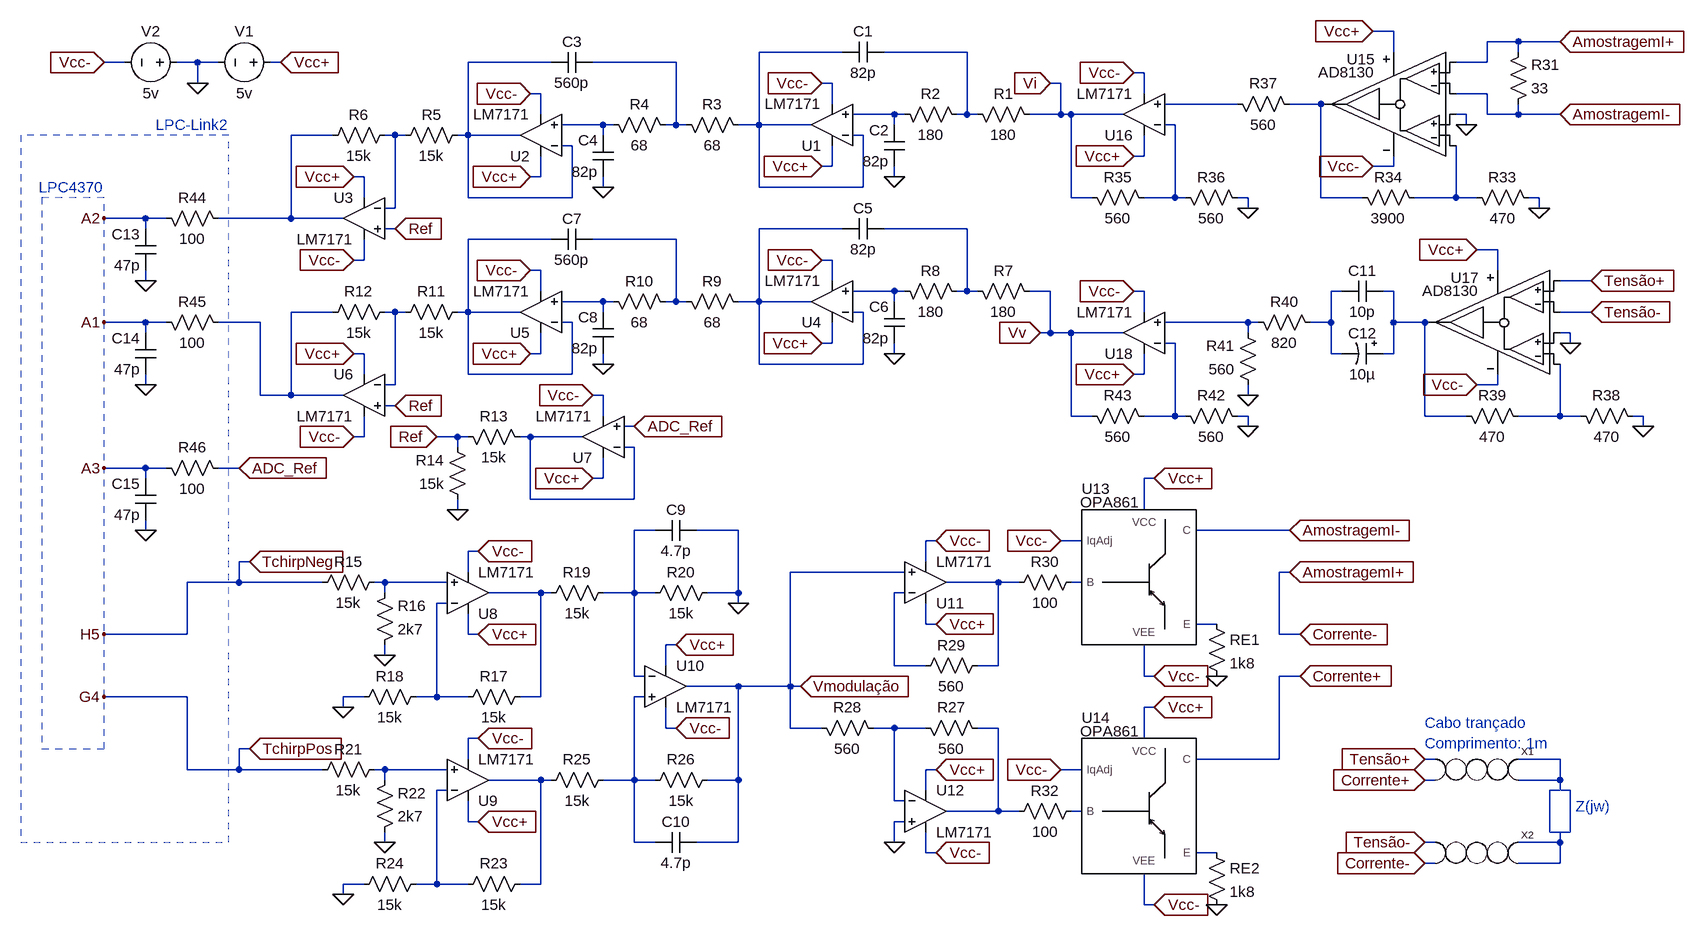
[diagram p0: schematic Circuito completo - Cop.asc]
Circuito completo - Cop.asc, the LTspice schematic file:
Version 4
SHEET 1 960 1160
WIRE -3216 -880 -3248 -880
WIRE -3024 -864 -3072 -864
WIRE -2960 -864 -3024 -864
WIRE -4064 -848 -4192 -848
WIRE -3872 -848 -4000 -848
WIRE -3216 -848 -3216 -880
WIRE -3024 -848 -3024 -864
WIRE -5168 -832 -5200 -832
WIRE -5056 -832 -5088 -832
WIRE -5024 -832 -5056 -832
WIRE -4928 -832 -4944 -832
WIRE -4512 -832 -4640 -832
WIRE -4320 -832 -4448 -832
WIRE -3072 -832 -3072 -864
WIRE -3072 -832 -3120 -832
WIRE -3600 -816 -3616 -816
WIRE -5056 -800 -5056 -832
WIRE -4080 -800 -4096 -800
WIRE -3728 -800 -3744 -800
WIRE -4528 -784 -4544 -784
WIRE -3600 -784 -3600 -816
WIRE -3072 -784 -3120 -784
WIRE -4080 -768 -4080 -800
WIRE -3456 -768 -3568 -768
WIRE -3328 -768 -3376 -768
WIRE -4528 -752 -4528 -784
WIRE -3984 -752 -4048 -752
WIRE -3968 -752 -3984 -752
WIRE -3872 -752 -3872 -848
WIRE -3872 -752 -3888 -752
WIRE -3856 -752 -3872 -752
WIRE -3728 -752 -3728 -800
WIRE -3728 -752 -3776 -752
WIRE -3712 -752 -3728 -752
WIRE -3632 -752 -3712 -752
WIRE -3104 -752 -3120 -752
WIRE -3072 -752 -3072 -784
WIRE -3024 -752 -3024 -768
WIRE -3024 -752 -3072 -752
WIRE -2960 -752 -3024 -752
WIRE -4432 -736 -4496 -736
WIRE -4416 -736 -4432 -736
WIRE -4320 -736 -4320 -832
WIRE -4320 -736 -4336 -736
WIRE -4304 -736 -4320 -736
WIRE -4192 -736 -4192 -848
WIRE -4192 -736 -4224 -736
WIRE -4112 -736 -4192 -736
WIRE -3984 -736 -3984 -752
WIRE -3552 -736 -3568 -736
WIRE -3104 -736 -3104 -752
WIRE -4848 -720 -4912 -720
WIRE -4752 -720 -4768 -720
WIRE -4736 -720 -4752 -720
WIRE -4640 -720 -4640 -832
WIRE -4640 -720 -4656 -720
WIRE -4560 -720 -4640 -720
WIRE -4432 -720 -4432 -736
WIRE -4032 -720 -4048 -720
WIRE -4480 -704 -4496 -704
WIRE -3600 -688 -3600 -720
WIRE -3600 -688 -3616 -688
WIRE -4080 -672 -4080 -704
WIRE -4080 -672 -4096 -672
WIRE -3216 -672 -3216 -688
WIRE -3216 -672 -3248 -672
WIRE -4800 -656 -4816 -656
WIRE -4528 -656 -4528 -688
WIRE -4528 -656 -4544 -656
WIRE -3984 -656 -3984 -672
WIRE -4432 -640 -4432 -656
WIRE -4192 -640 -4192 -736
WIRE -4032 -640 -4032 -720
WIRE -4032 -640 -4192 -640
WIRE -4800 -624 -4800 -656
WIRE -4640 -624 -4640 -720
WIRE -4480 -624 -4480 -704
WIRE -4480 -624 -4640 -624
WIRE -3712 -624 -3712 -752
WIRE -3680 -624 -3712 -624
WIRE -3552 -624 -3552 -736
WIRE -3552 -624 -3600 -624
WIRE -3536 -624 -3552 -624
WIRE -3440 -624 -3456 -624
WIRE -3328 -624 -3328 -768
WIRE -3264 -624 -3328 -624
WIRE -3120 -624 -3120 -704
WIRE -3120 -624 -3184 -624
WIRE -3088 -624 -3120 -624
WIRE -2992 -624 -3008 -624
WIRE -4752 -608 -4752 -720
WIRE -4752 -608 -4768 -608
WIRE -3440 -608 -3440 -624
WIRE -2992 -608 -2992 -624
WIRE -5136 -592 -5200 -592
WIRE -5104 -592 -5136 -592
WIRE -4912 -592 -4912 -720
WIRE -4912 -592 -5024 -592
WIRE -4832 -592 -4912 -592
WIRE -5136 -576 -5136 -592
WIRE -4752 -576 -4768 -576
WIRE -4064 -576 -4192 -576
WIRE -3872 -576 -4000 -576
WIRE -4512 -560 -4640 -560
WIRE -4320 -560 -4448 -560
WIRE -3056 -544 -3088 -544
WIRE -4800 -528 -4800 -560
WIRE -4800 -528 -4816 -528
WIRE -4080 -528 -4096 -528
WIRE -4528 -512 -4544 -512
WIRE -3056 -512 -3056 -544
WIRE -5136 -496 -5136 -512
WIRE -4080 -496 -4080 -528
WIRE -2912 -496 -2960 -496
WIRE -4528 -480 -4528 -512
WIRE -3984 -480 -4048 -480
WIRE -3968 -480 -3984 -480
WIRE -3872 -480 -3872 -576
WIRE -3872 -480 -3888 -480
WIRE -3856 -480 -3872 -480
WIRE -3744 -480 -3776 -480
WIRE -3600 -480 -3616 -480
WIRE -3296 -480 -3312 -480
WIRE -3216 -480 -3232 -480
WIRE -4432 -464 -4496 -464
WIRE -4416 -464 -4432 -464
WIRE -4320 -464 -4320 -560
WIRE -4320 -464 -4336 -464
WIRE -4304 -464 -4320 -464
WIRE -4192 -464 -4192 -576
WIRE -4192 -464 -4224 -464
WIRE -4112 -464 -4192 -464
WIRE -3984 -464 -3984 -480
WIRE -4848 -448 -4912 -448
WIRE -4752 -448 -4768 -448
WIRE -4736 -448 -4752 -448
WIRE -4640 -448 -4640 -560
WIRE -4640 -448 -4656 -448
WIRE -4560 -448 -4640 -448
WIRE -4432 -448 -4432 -464
WIRE -4032 -448 -4048 -448
WIRE -3600 -448 -3600 -480
WIRE -2912 -448 -2960 -448
WIRE -5136 -432 -5200 -432
WIRE -5104 -432 -5136 -432
WIRE -4960 -432 -5024 -432
WIRE -4480 -432 -4496 -432
WIRE -3440 -432 -3568 -432
WIRE -3424 -432 -3440 -432
WIRE -3312 -432 -3312 -480
WIRE -3312 -432 -3344 -432
WIRE -3216 -432 -3216 -480
WIRE -3168 -432 -3216 -432
WIRE -5136 -416 -5136 -432
WIRE -3744 -416 -3744 -480
WIRE -3744 -416 -3760 -416
WIRE -3712 -416 -3744 -416
WIRE -3632 -416 -3712 -416
WIRE -3440 -416 -3440 -432
WIRE -2944 -416 -2960 -416
WIRE -4080 -400 -4080 -432
WIRE -4080 -400 -4096 -400
WIRE -3552 -400 -3568 -400
WIRE -2944 -400 -2944 -416
WIRE -4800 -384 -4816 -384
WIRE -4528 -384 -4528 -416
WIRE -4528 -384 -4544 -384
WIRE -3984 -384 -3984 -400
WIRE -3312 -384 -3312 -432
WIRE -3296 -384 -3312 -384
WIRE -3216 -384 -3216 -432
WIRE -3216 -384 -3232 -384
WIRE -4432 -368 -4432 -384
WIRE -4192 -368 -4192 -464
WIRE -4032 -368 -4032 -448
WIRE -4032 -368 -4192 -368
WIRE -4800 -352 -4800 -384
WIRE -4640 -352 -4640 -448
WIRE -4480 -352 -4480 -432
WIRE -4480 -352 -4640 -352
WIRE -3600 -352 -3600 -384
WIRE -3600 -352 -3616 -352
WIRE -5136 -336 -5136 -352
WIRE -4752 -336 -4752 -448
WIRE -4752 -336 -4768 -336
WIRE -3056 -336 -3056 -352
WIRE -3056 -336 -3088 -336
WIRE -4960 -320 -4960 -432
WIRE -4912 -320 -4912 -448
WIRE -4912 -320 -4960 -320
WIRE -4832 -320 -4912 -320
WIRE -4432 -320 -4448 -320
WIRE -3440 -320 -3440 -336
WIRE -4752 -304 -4768 -304
WIRE -4432 -288 -4432 -320
WIRE -3712 -288 -3712 -416
WIRE -3680 -288 -3712 -288
WIRE -3552 -288 -3552 -400
WIRE -3552 -288 -3600 -288
WIRE -3536 -288 -3552 -288
WIRE -3440 -288 -3456 -288
WIRE -3168 -288 -3168 -432
WIRE -3104 -288 -3168 -288
WIRE -2960 -288 -2960 -368
WIRE -2960 -288 -3024 -288
WIRE -2928 -288 -2960 -288
WIRE -2832 -288 -2848 -288
WIRE -4384 -272 -4400 -272
WIRE -3440 -272 -3440 -288
WIRE -2832 -272 -2832 -288
WIRE -4800 -256 -4800 -288
WIRE -4800 -256 -4816 -256
WIRE -4656 -256 -4688 -256
WIRE -4640 -256 -4656 -256
WIRE -4544 -256 -4560 -256
WIRE -4464 -256 -4544 -256
WIRE -4656 -240 -4656 -256
WIRE -4384 -240 -4400 -240
WIRE -5136 -208 -5200 -208
WIRE -5104 -208 -5136 -208
WIRE -4992 -208 -5024 -208
WIRE -5136 -192 -5136 -208
WIRE -4432 -192 -4432 -224
WIRE -4432 -192 -4448 -192
WIRE -3584 -192 -3600 -192
WIRE -4544 -160 -4544 -256
WIRE -4384 -160 -4384 -240
WIRE -4384 -160 -4544 -160
WIRE -4656 -144 -4656 -160
WIRE -3600 -144 -3600 -192
WIRE -5136 -112 -5136 -128
WIRE -4352 -112 -4384 -112
WIRE -4224 -112 -4288 -112
WIRE -3376 -112 -3520 -112
WIRE -3920 -96 -3936 -96
WIRE -3696 -96 -3728 -96
WIRE -4624 -80 -4640 -80
WIRE -4976 -64 -4992 -64
WIRE -3936 -64 -3936 -96
WIRE -4640 -48 -4640 -80
WIRE -3968 -48 -4144 -48
WIRE -3376 -48 -3392 -48
WIRE -4992 -32 -4992 -64
WIRE -4992 -32 -5072 -32
WIRE -4864 -32 -4992 -32
WIRE -4768 -32 -4784 -32
WIRE -4672 -32 -4768 -32
WIRE -3824 -32 -3904 -32
WIRE -3792 -32 -3824 -32
WIRE -3696 -32 -3712 -32
WIRE -4768 -16 -4768 -32
WIRE -4528 -16 -4608 -16
WIRE -4512 -16 -4528 -16
WIRE -4384 -16 -4384 -112
WIRE -4384 -16 -4432 -16
WIRE -4352 -16 -4384 -16
WIRE -4224 -16 -4224 -112
WIRE -4224 -16 -4272 -16
WIRE -3968 -16 -3984 -16
WIRE -4672 0 -4688 0
WIRE -4224 0 -4224 -16
WIRE -3936 32 -3936 0
WIRE -3920 32 -3936 32
WIRE -3488 32 -3520 32
WIRE -5072 48 -5072 -32
WIRE -5072 48 -5200 48
WIRE -4640 48 -4640 16
WIRE -4624 48 -4640 48
WIRE -3392 48 -3392 -48
WIRE -3360 48 -3392 48
WIRE -4320 64 -4336 64
WIRE -4768 80 -4768 64
WIRE -4336 96 -4336 64
WIRE -3984 96 -3984 -16
WIRE -3936 96 -3984 96
WIRE -3824 96 -3824 -32
WIRE -3824 96 -3856 96
WIRE -4384 112 -4384 -16
WIRE -4368 112 -4384 112
WIRE -3600 112 -3600 64
WIRE -3584 112 -3600 112
WIRE -3360 112 -3392 112
WIRE -4224 128 -4304 128
WIRE -4144 128 -4144 -48
WIRE -4144 128 -4224 128
WIRE -4128 128 -4144 128
WIRE -5072 144 -5200 144
WIRE -4800 144 -4832 144
WIRE -4688 144 -4688 0
WIRE -4688 144 -4720 144
WIRE -4640 144 -4688 144
WIRE -4528 144 -4528 -16
WIRE -4528 144 -4560 144
WIRE -4368 144 -4384 144
WIRE -4832 160 -4832 144
WIRE -3584 160 -3600 160
WIRE -4336 192 -4336 160
WIRE -4320 192 -4336 192
WIRE -4144 192 -4144 128
WIRE -4096 192 -4144 192
WIRE -3984 192 -4016 192
WIRE -3936 192 -3984 192
WIRE -3824 192 -3856 192
WIRE -4624 208 -4640 208
WIRE -3600 208 -3600 160
WIRE -4976 224 -4992 224
WIRE -4640 240 -4640 208
WIRE -3392 240 -3392 112
WIRE -3392 240 -3520 240
WIRE -3152 240 -3168 240
WIRE -2960 240 -3024 240
WIRE -5072 256 -5072 144
WIRE -4992 256 -4992 224
WIRE -4992 256 -5072 256
WIRE -4864 256 -4992 256
WIRE -4768 256 -4784 256
WIRE -4672 256 -4768 256
WIRE -3920 256 -3936 256
WIRE -3696 256 -3728 256
WIRE -4768 272 -4768 256
WIRE -4528 272 -4608 272
WIRE -4512 272 -4528 272
WIRE -4384 272 -4384 144
WIRE -4384 272 -4432 272
WIRE -4352 272 -4384 272
WIRE -4224 272 -4224 128
WIRE -4224 272 -4272 272
WIRE -3152 272 -3168 272
WIRE -2960 272 -2960 240
WIRE -2960 272 -3024 272
WIRE -4672 288 -4688 288
WIRE -3936 288 -3936 256
WIRE -2960 288 -2960 272
WIRE -3984 304 -3984 192
WIRE -3968 304 -3984 304
WIRE -3824 320 -3824 192
WIRE -3824 320 -3904 320
WIRE -3792 320 -3824 320
WIRE -3696 320 -3712 320
WIRE -4640 336 -4640 304
WIRE -4624 336 -4640 336
WIRE -3968 336 -3984 336
WIRE -4768 368 -4768 352
WIRE -4384 368 -4384 272
WIRE -4352 368 -4384 368
WIRE -4224 368 -4224 272
WIRE -4224 368 -4288 368
WIRE -3984 368 -3984 336
WIRE -3152 368 -3168 368
WIRE -2960 368 -2960 352
WIRE -2960 368 -3024 368
WIRE -3936 384 -3936 352
WIRE -3920 384 -3936 384
WIRE -3488 384 -3520 384
WIRE -3152 400 -3168 400
WIRE -2960 400 -2960 368
WIRE -2960 400 -3024 400
WIRE -4800 432 -4832 432
WIRE -4688 432 -4688 288
WIRE -4688 432 -4720 432
WIRE -4640 432 -4688 432
WIRE -4528 432 -4528 272
WIRE -4528 432 -4560 432
WIRE -4832 448 -4832 432
WIRE -3600 464 -3600 416
WIRE -3584 464 -3600 464
FLAG -3984 -656 0
FLAG -4096 -672 Vcc+
IOPIN -4096 -672 In
FLAG -4096 -800 Vcc-
IOPIN -4096 -800 In
FLAG -4432 -640 0
FLAG -4544 -656 Vcc+
IOPIN -4544 -656 In
FLAG -4544 -784 Vcc-
IOPIN -4544 -784 In
FLAG -4816 -656 Vcc+
IOPIN -4816 -656 In
FLAG -4816 -528 Vcc-
IOPIN -4816 -528 In
FLAG -3984 -384 0
FLAG -4096 -400 Vcc+
IOPIN -4096 -400 In
FLAG -4096 -528 Vcc-
IOPIN -4096 -528 In
FLAG -4432 -368 0
FLAG -4544 -384 Vcc+
IOPIN -4544 -384 In
FLAG -4544 -512 Vcc-
IOPIN -4544 -512 In
FLAG -4816 -384 Vcc+
IOPIN -4816 -384 In
FLAG -4816 -256 Vcc-
IOPIN -4816 -256 In
FLAG -4448 -192 Vcc+
IOPIN -4448 -192 In
FLAG -4448 -320 Vcc-
IOPIN -4448 -320 In
FLAG -4656 -144 0
FLAG -4992 -208 ADC_Ref
IOPIN -4992 -208 In
FLAG -4688 -256 Ref
IOPIN -4688 -256 In
FLAG -4752 -304 Ref
IOPIN -4752 -304 In
FLAG -4752 -576 Ref
IOPIN -4752 -576 In
FLAG -4624 48 Vcc+
IOPIN -4624 48 In
FLAG -4624 -80 Vcc-
IOPIN -4624 -80 In
FLAG -4768 80 0
FLAG -4624 336 Vcc+
IOPIN -4624 336 In
FLAG -4624 208 Vcc-
IOPIN -4624 208 In
FLAG -4768 368 0
FLAG -4320 64 Vcc+
IOPIN -4320 64 In
FLAG -4320 192 Vcc-
IOPIN -4320 192 In
FLAG -4224 0 0
FLAG -4976 -64 TchirpNeg
IOPIN -4976 -64 In
FLAG -4976 224 TchirpPos
IOPIN -4976 224 In
FLAG -4832 448 0
FLAG -4832 160 0
FLAG -3920 32 Vcc+
IOPIN -3920 32 In
FLAG -3920 -96 Vcc-
IOPIN -3920 -96 In
FLAG -3920 256 Vcc+
IOPIN -3920 256 In
FLAG -3920 384 Vcc-
IOPIN -3920 384 In
FLAG -3584 112 Vcc-
IOPIN -3584 112 In
FLAG -3584 -192 Vcc+
IOPIN -3584 -192 In
FLAG -3488 112 0
FLAG -3584 464 Vcc-
IOPIN -3584 464 In
FLAG -3584 160 Vcc+
IOPIN -3584 160 In
FLAG -3488 464 0
FLAG -3728 -96 Vcc-
IOPIN -3728 -96 In
FLAG -3728 256 Vcc-
IOPIN -3728 256 In
FLAG -3104 -736 0
FLAG -2992 -608 0
FLAG -3616 -688 Vcc+
IOPIN -3616 -688 In
FLAG -3616 -816 Vcc-
IOPIN -3616 -816 In
FLAG -3440 -608 0
FLAG -3248 -672 Vcc-
IOPIN -3248 -672 In
FLAG -3248 -880 Vcc+
IOPIN -3248 -880 In
FLAG -3376 -112 AmostragemI-
IOPIN -3376 -112 In
FLAG -3376 -48 AmostragemI+
IOPIN -3376 -48 In
FLAG -2960 -752 AmostragemI-
IOPIN -2960 -752 In
FLAG -2960 -864 AmostragemI+
IOPIN -2960 -864 In
FLAG -2944 -400 0
FLAG -2832 -272 0
FLAG -3616 -352 Vcc+
IOPIN -3616 -352 In
FLAG -3616 -480 Vcc-
IOPIN -3616 -480 In
FLAG -3440 -272 0
FLAG -3088 -336 Vcc-
IOPIN -3088 -336 In
FLAG -3088 -544 Vcc+
IOPIN -3088 -544 In
FLAG -2912 -448 Tensão-
IOPIN -2912 -448 In
FLAG -2912 -496 Tensão+
IOPIN -2912 -496 In
FLAG -3440 -320 0
FLAG -3744 -800 Vi
IOPIN -3744 -800 In
FLAG -3760 -416 Vv
IOPIN -3760 -416 In
FLAG -3360 112 Corrente+
IOPIN -3360 112 In
FLAG -3360 48 Corrente-
IOPIN -3360 48 In
FLAG -5136 -496 0
FLAG -5136 -336 0
FLAG -5136 -112 0
FLAG -5200 -592 A2
FLAG -5200 -432 A1
FLAG -5200 -208 A3
FLAG -4128 128 Vmodulação
IOPIN -4128 128 In
FLAG -5200 48 H5
FLAG -5200 144 G4
FLAG -4384 -272 ADC_Ref
IOPIN -4384 -272 In
FLAG -3168 272 Corrente+
IOPIN -3168 272 In
FLAG -3168 240 Tensão+
IOPIN -3168 240 In
FLAG -3168 368 Tensão-
IOPIN -3168 368 In
FLAG -3168 400 Corrente-
IOPIN -3168 400 In
FLAG -5056 -800 0
FLAG -4928 -832 Vcc+
IOPIN -4928 -832 In
FLAG -5200 -832 Vcc-
IOPIN -5200 -832 In
FLAG -3984 368 0
SYMBOL Opamps\\opamp2 -4080 -672 R180
SYMATTR InstName U1
SYMATTR Value LM7171
SYMBOL res -3872 -768 M90
WINDOW 0 0 56 VBottom 2
WINDOW 3 32 56 VTop 2
SYMATTR InstName R1
SYMATTR Value 180
SYMBOL res -3984 -768 M90
WINDOW 0 0 56 VBottom 2
WINDOW 3 32 56 VTop 2
SYMATTR InstName R2
SYMATTR Value 180
SYMBOL cap -4064 -864 M90
WINDOW 0 0 32 VBottom 2
WINDOW 3 32 32 VTop 2
SYMATTR InstName C1
SYMATTR Value 82p
SYMBOL cap -3968 -736 M0
SYMATTR InstName C2
SYMATTR Value 82p
SYMBOL Opamps\\opamp2 -4528 -656 R180
SYMATTR InstName U2
SYMATTR Value LM7171
SYMBOL res -4320 -752 M90
WINDOW 0 0 56 VBottom 2
WINDOW 3 32 56 VTop 2
SYMATTR InstName R3
SYMATTR Value 68
SYMBOL res -4432 -752 M90
WINDOW 0 0 56 VBottom 2
WINDOW 3 32 56 VTop 2
SYMATTR InstName R4
SYMATTR Value 68
SYMBOL cap -4512 -848 M90
WINDOW 0 0 32 VBottom 2
WINDOW 3 32 32 VTop 2
SYMATTR InstName C3
SYMATTR Value 560p
SYMBOL cap -4416 -720 M0
SYMATTR InstName C4
SYMATTR Value 82p
SYMBOL Opamps\\opamp2 -4800 -656 M0
SYMATTR InstName U3
SYMATTR Value LM7171
SYMBOL res -4752 -704 R270
WINDOW 0 32 56 VTop 2
WINDOW 3 0 56 VBottom 2
SYMATTR InstName R5
SYMATTR Value 15k
SYMBOL res -4864 -704 R270
WINDOW 0 32 56 VTop 2
WINDOW 3 0 56 VBottom 2
SYMATTR InstName R6
SYMATTR Value 15k
SYMBOL Opamps\\opamp2 -4080 -400 R180
SYMATTR InstName U4
SYMATTR Value LM7171
SYMBOL res -3872 -496 M90
WINDOW 0 0 56 VBottom 2
WINDOW 3 32 56 VTop 2
SYMATTR InstName R7
SYMATTR Value 180
SYMBOL res -3984 -496 M90
WINDOW 0 0 56 VBottom 2
WINDOW 3 32 56 VTop 2
SYMATTR InstName R8
SYMATTR Value 180
SYMBOL cap -4064 -592 M90
WINDOW 0 0 32 VBottom 2
WINDOW 3 32 32 VTop 2
SYMATTR InstName C5
SYMATTR Value 82p
SYMBOL cap -3968 -464 M0
SYMATTR InstName C6
SYMATTR Value 82p
SYMBOL Opamps\\opamp2 -4528 -384 R180
SYMATTR InstName U5
SYMATTR Value LM7171
SYMBOL res -4320 -480 M90
WINDOW 0 0 56 VBottom 2
WINDOW 3 32 56 VTop 2
SYMATTR InstName R9
SYMATTR Value 68
SYMBOL res -4432 -480 M90
WINDOW 0 0 56 VBottom 2
WINDOW 3 32 56 VTop 2
SYMATTR InstName R10
SYMATTR Value 68
SYMBOL cap -4512 -576 M90
WINDOW 0 0 32 VBottom 2
WINDOW 3 32 32 VTop 2
SYMATTR InstName C7
SYMATTR Value 560p
SYMBOL cap -4416 -448 M0
SYMATTR InstName C8
SYMATTR Value 82p
SYMBOL Opamps\\opamp2 -4800 -384 M0
SYMATTR InstName U6
SYMATTR Value LM7171
SYMBOL res -4752 -432 R270
WINDOW 0 32 56 VTop 2
WINDOW 3 0 56 VBottom 2
SYMATTR InstName R11
SYMATTR Value 15k
SYMBOL res -4864 -432 R270
WINDOW 0 32 56 VTop 2
WINDOW 3 0 56 VBottom 2
SYMATTR InstName R12
SYMATTR Value 15k
SYMBOL Opamps\\opamp2 -4432 -192 R180
SYMATTR InstName U7
SYMATTR Value LM7171
SYMBOL res -4656 -272 M90
WINDOW 0 0 56 VBottom 2
WINDOW 3 32 56 VTop 2
SYMATTR InstName R13
SYMATTR Value 15k
SYMBOL res -4640 -144 R180
WINDOW 0 36 76 Left 2
WINDOW 3 36 40 Left 2
SYMATTR InstName R14
SYMATTR Value 15k
SYMBOL Opamps\\opamp2 -4640 48 M180
SYMATTR InstName U8
SYMATTR Value LM7171
SYMBOL res -4768 -48 R90
WINDOW 0 0 56 VBottom 2
WINDOW 3 32 56 VTop 2
SYMATTR InstName R15
SYMATTR Value 15k
SYMBOL res -4784 80 M180
WINDOW 0 36 76 Left 2
WINDOW 3 36 40 Left 2
SYMATTR InstName R16
SYMATTR Value 2k7
SYMBOL res -4544 128 R90
WINDOW 0 0 56 VBottom 2
WINDOW 3 32 56 VTop 2
SYMATTR InstName R17
SYMATTR Value 15k
SYMBOL res -4816 160 R270
WINDOW 0 32 56 VTop 2
WINDOW 3 0 56 VBottom 2
SYMATTR InstName R18
SYMATTR Value 15k
SYMBOL res -4416 -32 R90
WINDOW 0 0 56 VBottom 2
WINDOW 3 32 56 VTop 2
SYMATTR InstName R19
SYMATTR Value 15k
SYMBOL res -4256 -32 R90
WINDOW 0 0 56 VBottom 2
WINDOW 3 32 56 VTop 2
SYMATTR InstName R20
SYMATTR Value 15k
SYMBOL cap -4288 -128 R90
WINDOW 0 0 32 VBottom 2
WINDOW 3 32 32 VTop 2
SYMATTR InstName C9
SYMATTR Value 4.7p
SYMBOL Opamps\\opamp2 -4640 336 M180
SYMATTR InstName U9
SYMATTR Value LM7171
SYMBOL res -4768 240 R90
WINDOW 0 0 56 VBottom 2
WINDOW 3 32 56 VTop 2
SYMATTR InstName R21
SYMATTR Value 15k
SYMBOL res -4784 368 M180
WINDOW 0 36 76 Left 2
WINDOW 3 36 40 Left 2
SYMATTR InstName R22
SYMATTR Value 2k7
SYMBOL res -4544 416 R90
WINDOW 0 0 56 VBottom 2
WINDOW 3 32 56 VTop 2
SYMATTR InstName R23
SYMATTR Value 15k
SYMBOL res -4816 448 R270
WINDOW 0 32 56 VTop 2
WINDOW 3 0 56 VBottom 2
SYMATTR InstName R24
SYMATTR Value 15k
SYMBOL Opamps\\opamp2 -4336 64 R0
SYMATTR InstName U10
SYMATTR Value LM7171
SYMBOL res -4416 256 R90
WINDOW 0 0 56 VBottom 2
WINDOW 3 32 56 VTop 2
SYMATTR InstName R25
SYMATTR Value 15k
SYMBOL res -4256 256 R90
WINDOW 0 0 56 VBottom 2
WINDOW 3 32 56 VTop 2
SYMATTR InstName R26
SYMATTR Value 15k
SYMBOL cap -4288 352 R90
WINDOW 0 0 32 VBottom 2
WINDOW 3 32 32 VTop 2
SYMATTR InstName C10
SYMATTR Value 4.7p
SYMBOL Opamps\\opamp2 -3936 32 M180
SYMATTR InstName U11
SYMATTR Value LM7171
SYMBOL res -3840 80 R90
WINDOW 0 0 56 VBottom 2
WINDOW 3 32 56 VTop 2
SYMATTR InstName R29
SYMATTR Value 560
SYMBOL Opamps\\opamp2 -3936 256 R0
SYMATTR InstName U12
SYMATTR Value LM7171
SYMBOL res -3840 208 M270
WINDOW 0 32 56 VTop 2
WINDOW 3 0 56 VBottom 2
SYMATTR InstName R27
SYMATTR Value 560
SYMBOL res -4000 208 M270
WINDOW 0 32 56 VTop 2
WINDOW 3 0 56 VBottom 2
SYMATTR InstName R28
SYMATTR Value 560
SYMBOL opa681 -3632 0 R0
SYMATTR InstName U13
SYMBOL res -3504 16 R0
SYMATTR InstName RE1
SYMATTR Value 1k8
SYMBOL res -3696 -48 R90
WINDOW 0 0 56 VBottom 2
WINDOW 3 32 56 VTop 2
SYMATTR InstName R30
SYMATTR Value 100
SYMBOL opa681 -3632 352 R0
SYMATTR InstName U14
SYMBOL res -3504 368 R0
SYMATTR InstName RE2
SYMATTR Value 1k8
SYMBOL res -3696 304 R90
WINDOW 0 0 56 VBottom 2
WINDOW 3 32 56 VTop 2
SYMATTR InstName R32
SYMATTR Value 100
SYMBOL res -3040 -752 M180
WINDOW 0 36 76 Left 2
WINDOW 3 36 40 Left 2
SYMATTR InstName R31
SYMATTR Value 33
SYMBOL ad8130 -3200 -768 M0
SYMATTR InstName U15
SYMBOL res -3104 -640 M90
WINDOW 0 0 56 VBottom 2
WINDOW 3 32 56 VTop 2
SYMATTR InstName R33
SYMATTR Value 470
SYMBOL res -3280 -640 M90
WINDOW 0 0 56 VBottom 2
WINDOW 3 32 56 VTop 2
SYMATTR InstName R34
SYMATTR Value 3900
SYMBOL res -3472 -784 M90
WINDOW 0 0 56 VBottom 2
WINDOW 3 32 56 VTop 2
SYMATTR InstName R37
SYMATTR Value 560
SYMBOL Opamps\\opamp2 -3600 -688 R180
SYMATTR InstName U16
SYMATTR Value LM7171
SYMBOL res -3696 -640 M90
WINDOW 0 0 56 VBottom 2
WINDOW 3 32 56 VTop 2
SYMATTR InstName R35
SYMATTR Value 560
SYMBOL res -3552 -640 M90
WINDOW 0 0 56 VBottom 2
WINDOW 3 32 56 VTop 2
SYMATTR InstName R36
SYMATTR Value 560
SYMBOL ad8130 -3040 -432 M0
SYMATTR InstName U17
SYMBOL res -2944 -304 M90
WINDOW 0 0 56 VBottom 2
WINDOW 3 32 56 VTop 2
SYMATTR InstName R38
SYMATTR Value 470
SYMBOL res -3120 -304 M90
WINDOW 0 0 56 VBottom 2
WINDOW 3 32 56 VTop 2
SYMATTR InstName R39
SYMATTR Value 470
SYMBOL res -3440 -448 M90
WINDOW 0 0 56 VBottom 2
WINDOW 3 32 56 VTop 2
SYMATTR InstName R40
SYMATTR Value 820
SYMBOL Opamps\\opamp2 -3600 -352 R180
SYMATTR InstName U18
SYMATTR Value LM7171
SYMBOL res -3696 -304 M90
WINDOW 0 0 56 VBottom 2
WINDOW 3 32 56 VTop 2
SYMATTR InstName R43
SYMATTR Value 560
SYMBOL res -3552 -304 M90
WINDOW 0 0 56 VBottom 2
WINDOW 3 32 56 VTop 2
SYMATTR InstName R42
SYMATTR Value 560
SYMBOL cap -3296 -496 M90
WINDOW 0 0 32 VBottom 2
WINDOW 3 32 32 VTop 2
SYMATTR InstName C11
SYMATTR Value 10p
SYMBOL polcap -3232 -400 R90
WINDOW 0 0 32 VBottom 2
WINDOW 3 32 32 VTop 2
SYMATTR InstName C12
SYMATTR Value 10µ
SYMATTR Description Capacitor
SYMATTR Type cap
SYMATTR SpiceLine V=4 Irms=3.72678 Rser=0.018 Lser=0 mfg="KEMET" pn="A700D107M004ATE018" type="Al electrolytic"
SYMBOL res -3424 -320 R180
WINDOW 0 36 76 Left 2
WINDOW 3 36 40 Left 2
SYMATTR InstName R41
SYMATTR Value 560
SYMBOL res -5120 -608 M90
WINDOW 0 0 56 VBottom 2
WINDOW 3 32 56 VTop 2
SYMATTR InstName R44
SYMATTR Value 100
SYMBOL cap -5120 -576 M0
SYMATTR InstName C13
SYMATTR Value 47p
SYMBOL res -5120 -448 M90
WINDOW 0 0 56 VBottom 2
WINDOW 3 32 56 VTop 2
SYMATTR InstName R45
SYMATTR Value 100
SYMBOL cap -5120 -416 M0
SYMATTR InstName C14
SYMATTR Value 47p
SYMBOL res -5120 -224 M90
WINDOW 0 0 56 VBottom 2
WINDOW 3 32 56 VTop 2
SYMATTR InstName R46
SYMATTR Value 100
SYMBOL cap -5120 -192 M0
SYMATTR InstName C15
SYMATTR Value 47p
SYMBOL twistedPair -3088 256 R0
SYMATTR InstName X1
SYMBOL twistedPair -3088 384 R0
SYMATTR InstName X2
SYMBOL voltage -4928 -832 R90
WINDOW 0 -32 56 VBottom 2
WINDOW 3 32 56 VTop 2
SYMATTR InstName V1
SYMATTR Value 5v
SYMBOL voltage -5072 -832 R90
WINDOW 0 -32 56 VBottom 2
WINDOW 3 32 56 VTop 2
SYMATTR InstName V2
SYMATTR Value 5v
TEXT -5008 -736 Right 2 ;LPC-Link2
TEXT -5200 -640 Right 2 ;LPC4370
TEXT -2936 312 Left 2 ;Z(jw)
TEXT -3168 184 Left 2 ;Cabo trançado\nComprimento: 1m
RECTANGLE Normal -5328 368 -5008 -720 2
RECTANGLE Normal -5296 224 -5200 -624 2
RECTANGLE Normal -2944 352 -2976 288

The netlist it stands for:
* Circuito completo - Cop.asc
XU1 N007 N001 Vcc+ Vcc- N001 LM7171  ; pins In+ In- V+ V- OUT
R1 N002 Vi 180
R2 N007 N002 180
C1 N001 N002 82p
C2 N007 0 82p
XU2 N008 N003 Vcc+ Vcc- N003 LM7171  ; pins In+ In- V+ V- OUT
R3 N004 N001 68
R4 N008 N004 68
C3 N003 N004 560p
C4 N008 0 82p
XU3 Ref N011 Vcc+ Vcc- N010 LM7171  ; pins In+ In- V+ V- OUT
R5 N011 N003 15k
R6 N010 N011 15k
XU4 N017 N013 Vcc+ Vcc- N013 LM7171  ; pins In+ In- V+ V- OUT
R7 N014 Vv 180
R8 N017 N014 180
C5 N013 N014 82p
C6 N017 0 82p
XU5 N020 N015 Vcc+ Vcc- N015 LM7171  ; pins In+ In- V+ V- OUT
R9 N016 N013 68
R10 N020 N016 68
C7 N015 N016 560p
C8 N020 0 82p
XU6 Ref N022 Vcc+ Vcc- N021 LM7171  ; pins In+ In- V+ V- OUT
R11 N022 N015 15k
R12 N021 N022 15k
XU7 ADC_Ref N026 Vcc+ Vcc- N026 LM7171  ; pins In+ In- V+ V- OUT
R13 Ref N026 15k
R14 0 Ref 15k
XU8 N028 N033 Vcc+ Vcc- N031 LM7171  ; pins In+ In- V+ V- OUT
R15 N028 H5 15k
R16 0 N028 2k7
R17 N031 N033 15k
R18 0 N033 15k
R19 N027 N031 15k
R20 0 N027 15k
C9 0 N027 4.7p
XU9 N039 N041 Vcc+ Vcc- N040 LM7171  ; pins In+ In- V+ V- OUT
R21 N039 G4 15k
R22 0 N039 2k7
R23 N040 N041 15k
R24 0 N041 15k
XU10 N035 N027 Vcc+ Vcc- Vmodulação LM7171  ; pins In+ In- V+ V- OUT
R25 N035 N040 15k
R26 Vmodulação N035 15k
C10 Vmodulação N035 4.7p
XU11 Vmodulação N032 Vcc+ Vcc- N029 LM7171  ; pins In+ In- V+ V- OUT
R29 N029 N032 560
XU12 0 N036 Vcc+ Vcc- N037 LM7171  ; pins In+ In- V+ V- OUT
R27 N037 N036 560
R28 N036 Vmodulação 560
XU13 N030 AmostragemI- N034 Vcc- Vcc+ Vcc- OPA861  ; pins B C E IqAdj VCC VEE
RE1 N034 0 1k8
R30 N030 N029 100
XU14 N042 Corrente+ N044 Vcc- Vcc+ Vcc- OPA861  ; pins B C E IqAdj VCC VEE
RE2 N044 0 1k8
R32 N042 N037 100
R31 AmostragemI- Corrente- 33
XU15 Corrente- AmostragemI- 0 N012 Vcc+ Vcc- N006 AD8130  ; pins 1 2 3 4 99 50 45
R33 N012 0 470
R34 N006 N012 3900
R37 N005 N006 560
XU16 N005 N009 Vcc+ Vcc- Vi LM7171  ; pins In+ In- V+ V- OUT
R35 Vi N009 560
R36 N009 0 560
XU17 Tensão+ Tensão- 0 N025 Vcc+ Vcc- N019 AD8130  ; pins 1 2 3 4 99 50 45
R38 N025 0 470
R39 N019 N025 470
R40 N023 N018 820
XU18 N023 N024 Vcc+ Vcc- Vv LM7171  ; pins In+ In- V+ V- OUT
R43 Vv N024 560
R42 N024 0 560
C11 N018 N019 10p
C12 N019 N018 10µ V=4 Irms=3.72678 Rser=0.018 Lser=0 mfg="KEMET" pn="A700D107M004ATE018" type="Al electrolytic"
R41 0 N023 560
R44 A2 N010 100
C13 A2 0 47p
R45 A1 N021 100
C14 A1 0 47p
R46 A3 ADC_Ref 100
C15 A3 0 47p
XX1 Tensão+ Corrente+ N038 N038 twistedPair
XX2 Tensão- Corrente- N043 N043 twistedPair
V1 Vcc+ 0 5v
V2 0 Vcc- 5v
* LPC-Link2
* LPC4370
* Z(jw)
* Cabo trançado
* Comprimento: 1m
.lib .\OPA861Model.sub
.lib .\ad8130.cir
.backanno
.end